# Altium schematic sheet 14-DPLL_1.SchDoc
size C; SheetNumber: 9; SheetTotal: 14
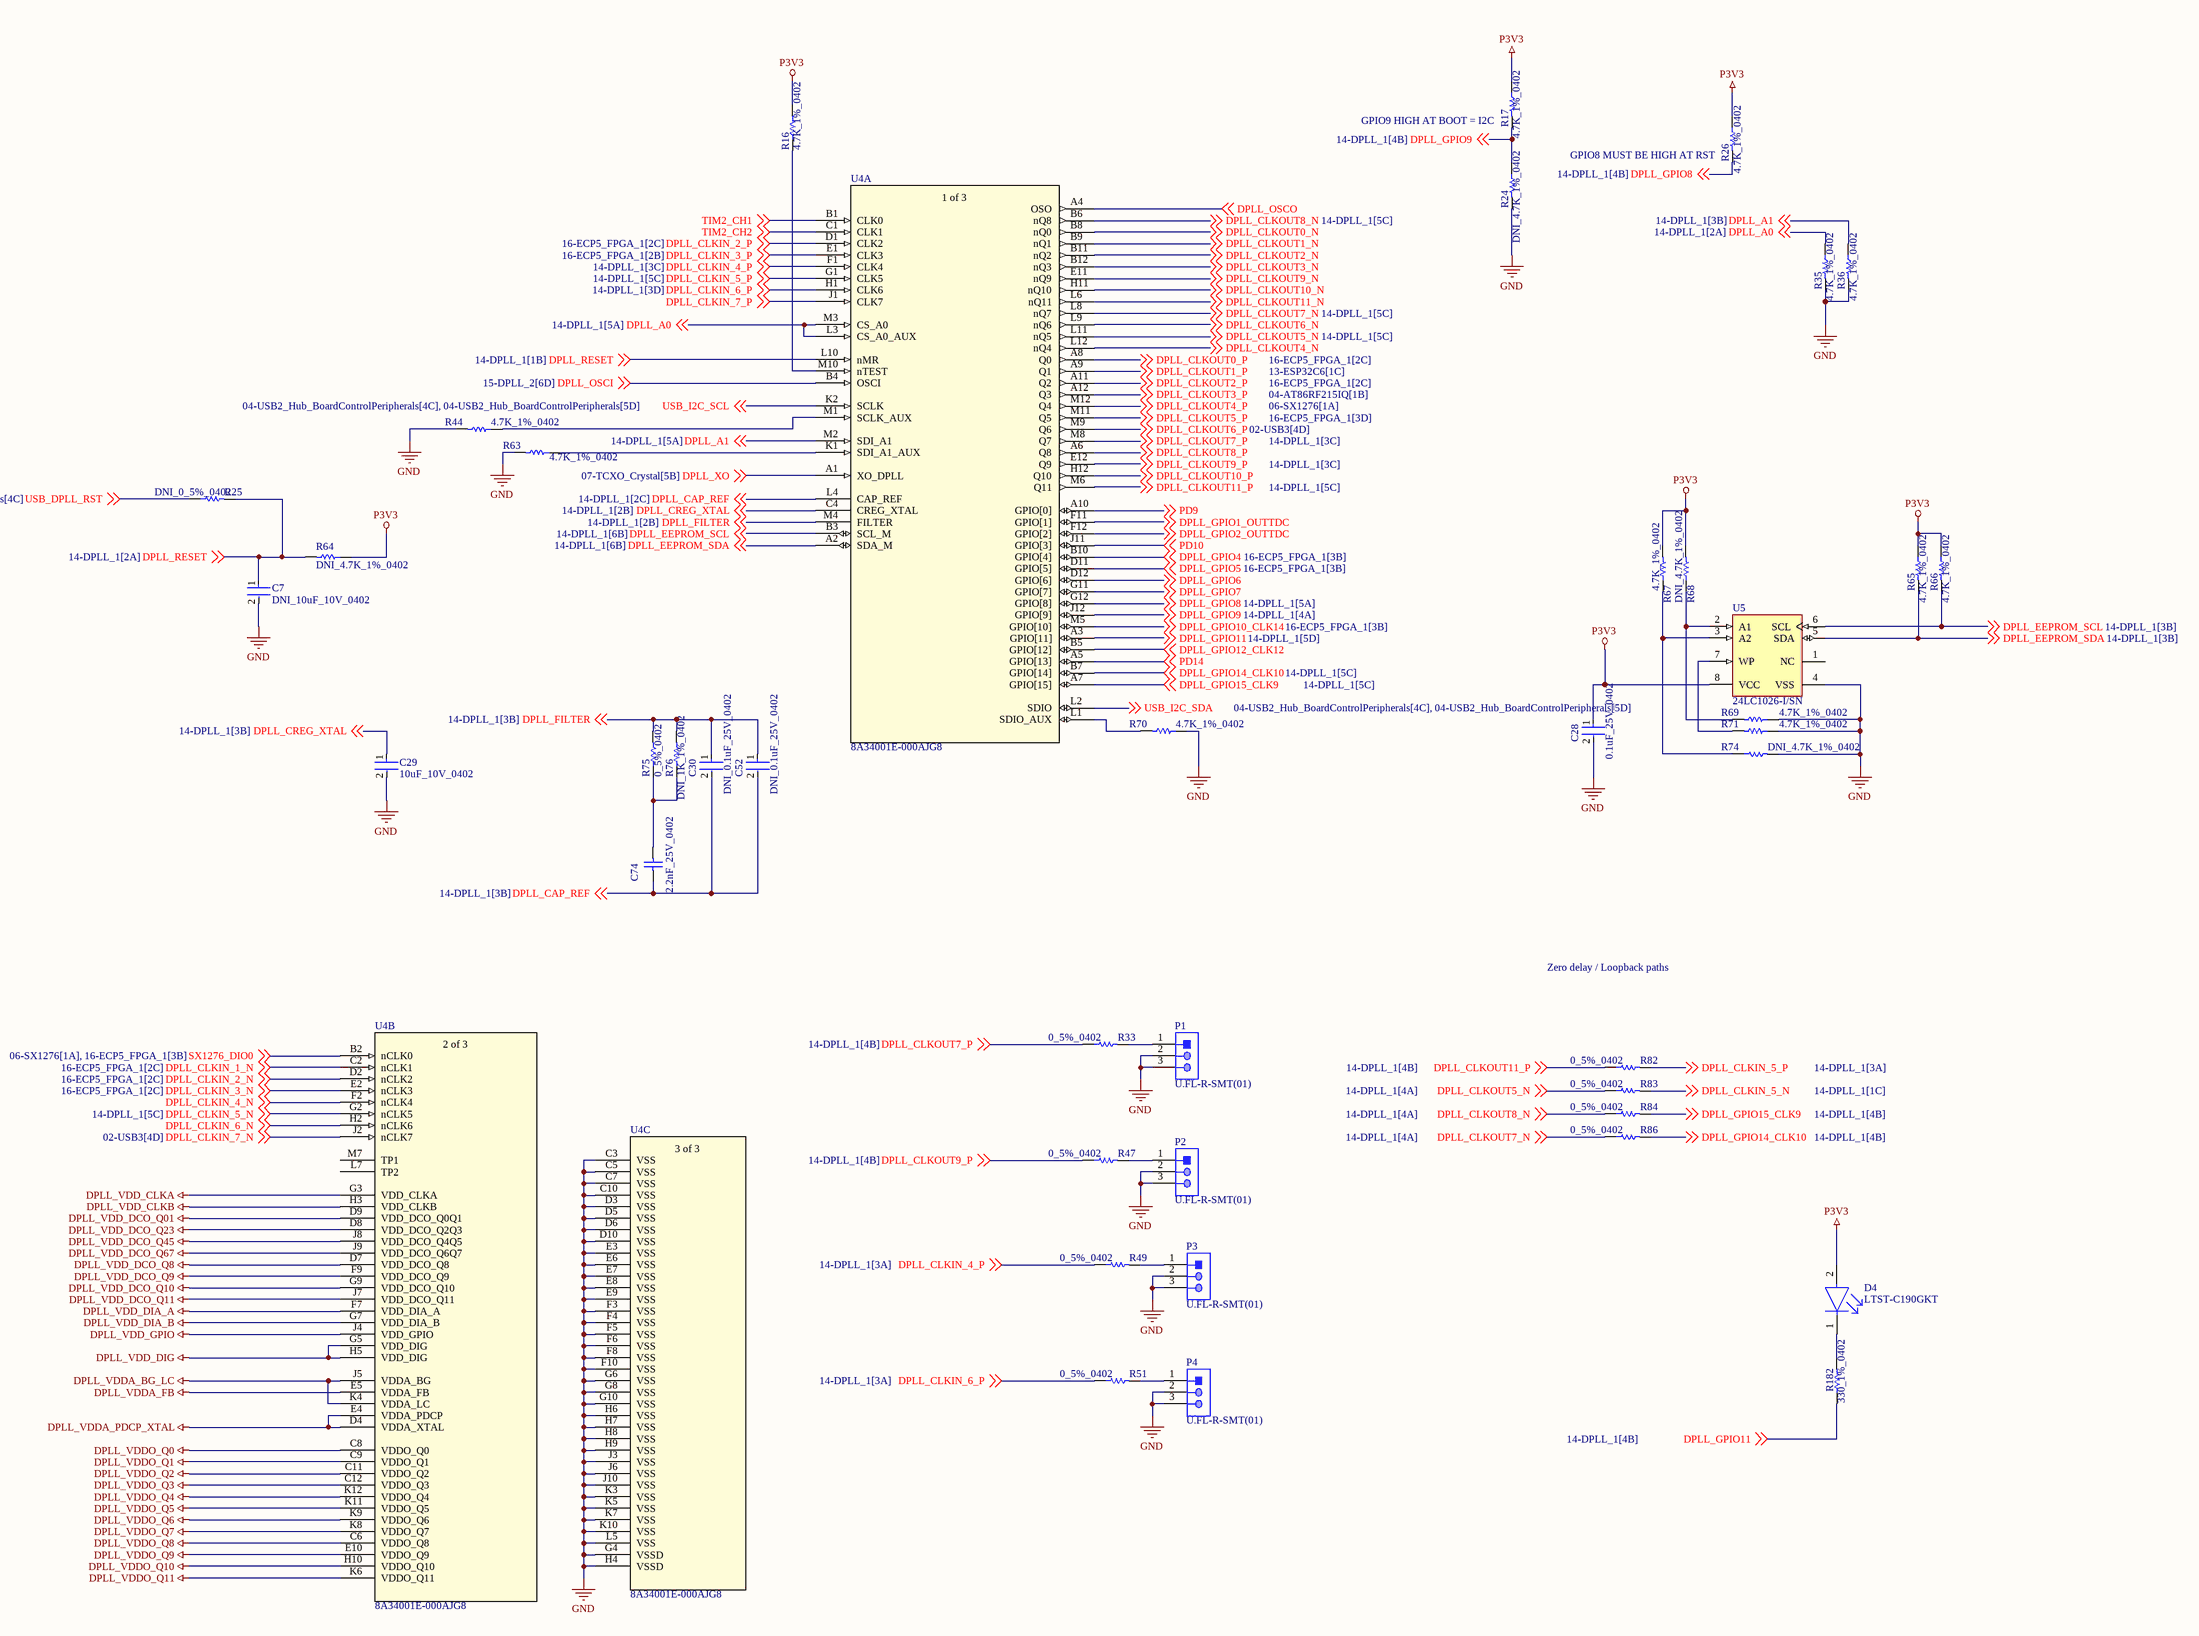
[diagram p0: 14-DPLL_1.SchDoc]

## Parts
C7  DNI_10uF_10V_0402  [FP-CL05A106MP5NUNC-MFG]  (no BOM)
C28  0.1uF_25V_0402  [FP-0402-L_1_0_1-W_0_5_0_1-IPC_C]
C29  10uF_10V_0402  [FP-CL05A106MP5NUNC-MFG]
C30  DNI_0.1uF_25V_0402  [FP-0402-L_1_0_1-W_0_5_0_1-IPC_C]  (no BOM)
C52  DNI_0.1uF_25V_0402  [FP-0402-L_1_0_1-W_0_5_0_1-IPC_C]  (no BOM)
C74  2.2nF_25V_0402  [CAPC1005X56X25LL10T15]
D4  LTST-C190GKT  [FP-LTST-C190GKT-MFG]
P1  U.FL-R-SMT(01)  [HRS-U.FL-R-SMT(10)_V]
P2  U.FL-R-SMT(01)  [HRS-U.FL-R-SMT(10)_V]
P3  U.FL-R-SMT(01)  [HRS-U.FL-R-SMT(10)_V]
P4  U.FL-R-SMT(01)  [HRS-U.FL-R-SMT(10)_V]
R16  4.7K_1%_0402  [RESC1005X40X25NL10T10]
R17  4.7K_1%_0402  [RESC1005X40X25NL10T10]
R24  DNI_4.7K_1%_0402  [RESC1005X40X25NL10T10]  (no BOM)
R25  DNI_0_5%_0402  [RESC1005X40X25LL10T10]  (no BOM)
R26  4.7K_1%_0402  [RESC1005X40X25NL10T10]
R33  0_5%_0402  [RESC1005X40X25LL10T10]
R35  4.7K_1%_0402  [RESC1005X40X25NL10T10]
R36  4.7K_1%_0402  [RESC1005X40X25NL10T10]
R44  4.7K_1%_0402  [RESC1005X40X25NL10T10]
R47  0_5%_0402  [RESC1005X40X25LL10T10]
R49  0_5%_0402  [RESC1005X40X25LL10T10]
R51  0_5%_0402  [RESC1005X40X25LL10T10]
R63  4.7K_1%_0402  [RESC1005X40X25NL10T10]
R64  DNI_4.7K_1%_0402  [RESC1005X40X25NL10T10]  (no BOM)
R65  4.7K_1%_0402  [RESC1005X40X25NL10T10]
R66  4.7K_1%_0402  [RESC1005X40X25NL10T10]
R67  4.7K_1%_0402  [RESC1005X40X25NL10T10]
R68  DNI_4.7K_1%_0402  [RESC1005X40X25NL10T10]  (no BOM)
R69  4.7K_1%_0402  [RESC1005X40X25NL10T10]
R70  4.7K_1%_0402  [RESC1005X40X25NL10T10]
R71  4.7K_1%_0402  [RESC1005X40X25NL10T10]
R74  DNI_4.7K_1%_0402  [RESC1005X40X25NL10T10]  (no BOM)
R75  0_5%_0402  [RESC1005X40X25LL10T10]
R76  DNI_1K_1%_0402  [RESC1005X40X25NL05T05]  (no BOM)
R82  0_5%_0402  [RESC1005X40X25LL10T10]
R83  0_5%_0402  [RESC1005X40X25LL10T10]
R84  0_5%_0402  [RESC1005X40X25LL10T10]
R86  0_5%_0402  [RESC1005X40X25LL10T10]
R182  330_1%_0402  [RESC1005X40X25NL10T10]
U4  8A34001E-000AJG8  [144-CABGA_REN]  (parts A,B,C of 3)
U5  24LC1026-I/SN  [MCHP-SOIC-SN8_N]

## Nets
DPLL_VDD_CLKA: U4.G3(VDD_CLKA)
DPLL_VDD_CLKB: U4.H3(VDD_CLKB)
DPLL_VDD_DCO_Q01: U4.D9(VDD_DCO_Q0Q1)
DPLL_VDD_DCO_Q8: U4.D7(VDD_DCO_Q8)
DPLL_VDD_DCO_Q9: U4.F9(VDD_DCO_Q9)
DPLL_VDD_DCO_Q10: U4.G9(VDD_DCO_Q10)
DPLL_VDD_DCO_Q11: U4.J7(VDD_DCO_Q11)
DPLL_VDD_DCO_Q23: U4.D8(VDD_DCO_Q2Q3)
DPLL_VDD_DCO_Q45: U4.J8(VDD_DCO_Q4Q5)
DPLL_VDD_DCO_Q67: U4.J9(VDD_DCO_Q6Q7)
DPLL_VDD_DIA_A: U4.F7(VDD_DIA_A)
DPLL_VDD_DIA_B: U4.G7(VDD_DIA_B)
DPLL_VDD_DIG: U4.G5(VDD_DIG) U4.H5(VDD_DIG)
DPLL_VDD_GPIO: U4.J4(VDD_GPIO)
DPLL_VDDA_BG_LC: U4.J5(VDDA_BG) U4.K4(VDDA_LC)
DPLL_VDDA_FB: U4.E5(VDDA_FB)
DPLL_VDDA_PDCP_XTAL: U4.D4(VDDA_XTAL) U4.E4(VDDA_PDCP)
DPLL_VDDO_Q0: U4.C8(VDDO_Q0)
DPLL_VDDO_Q1: U4.C9(VDDO_Q1)
DPLL_VDDO_Q2: U4.C11(VDDO_Q2)
DPLL_VDDO_Q3: U4.C12(VDDO_Q3)
DPLL_VDDO_Q4: U4.K12(VDDO_Q4)
DPLL_VDDO_Q5: U4.K11(VDDO_Q5)
DPLL_VDDO_Q6: U4.K9(VDDO_Q6)
DPLL_VDDO_Q7: U4.K8(VDDO_Q7)
DPLL_VDDO_Q8: U4.C6(VDDO_Q8)
DPLL_VDDO_Q9: U4.E10(VDDO_Q9)
DPLL_VDDO_Q10: U4.H10(VDDO_Q10)
DPLL_VDDO_Q11: U4.K6(VDDO_Q11)
GND: C7.2 C28.2 C29.2 P1.2 P1.3 P2.2 P2.3 P3.2 P3.3 P4.2 P4.3 R24.2 R35.2 R36.2 R44.2 R63.2 R69.1 R70.1 R71.1 R74.2 U4.C3(VSS) U4.C5(VSS) U4.C7(VSS) U4.C10(VSS) U4.D3(VSS) U4.D5(VSS) U4.D6(VSS) U4.D10(VSS) U4.E3(VSS) U4.E6(VSS) U4.E7(VSS) U4.E8(VSS) U4.E9(VSS) U4.F3(VSS) U4.F4(VSS) U4.F5(VSS) U4.F6(VSS) U4.F8(VSS) U4.F10(VSS) U4.G4(VSSD) U4.G6(VSS) U4.G8(VSS) U4.G10(VSS) U4.H4(VSSD) U4.H6(VSS) U4.H7(VSS) U4.H8(VSS) U4.H9(VSS) U4.J3(VSS) U4.J6(VSS) U4.J10(VSS) U4.K3(VSS) U4.K5(VSS) U4.K7(VSS) U4.K10(VSS) U4.L5(VSS) U5.4(VSS)
P3V3: C28.1 D4.2(A) R16.2 R17.1 R26.1 R64.1 R65.1 R66.1 R67.2 R68.2 U5.8(VCC)
DPLL_A0: R35.1 U4.L3(CS_A0_AUX) U4.M3(CS_A0) ; off-sheet DPLL_A0
DPLL_A1: R36.1 U4.M2(SDI_A1) ; off-sheet DPLL_A1
DPLL_CAP_REF: C30.2 C52.2 C74.1 U4.L4(CAP_REF) ; off-sheet DPLL_CAP_REF
DPLL_CLKIN_1_N: U4.C2(nCLK1) ; off-sheet DPLL_CLKIN_1_N
DPLL_CLKIN_2_N: U4.D2(nCLK2) ; off-sheet DPLL_CLKIN_2_N
DPLL_CLKIN_2_P: U4.D1(CLK2) ; off-sheet DPLL_CLKIN_2_P
DPLL_CLKIN_3_N: U4.E2(nCLK3) ; off-sheet DPLL_CLKIN_3_N
DPLL_CLKIN_3_P: U4.E1(CLK3) ; off-sheet DPLL_CLKIN_3_P
DPLL_CLKIN_4_N: U4.F2(nCLK4) ; off-sheet DPLL_CLKIN_4_N
DPLL_CLKIN_4_P: R49.1 U4.F1(CLK4) ; off-sheet DPLL_CLKIN_4_P
DPLL_CLKIN_5_N: R83.2 U4.G2(nCLK5) ; off-sheet DPLL_CLKIN_5_N
DPLL_CLKIN_5_P: R82.2 U4.G1(CLK5) ; off-sheet DPLL_CLKIN_5_P
DPLL_CLKIN_6_N: U4.H2(nCLK6) ; off-sheet DPLL_CLKIN_6_N
DPLL_CLKIN_6_P: R51.1 U4.H1(CLK6) ; off-sheet DPLL_CLKIN_6_P
DPLL_CLKIN_7_N: U4.J2(nCLK7) ; off-sheet DPLL_CLKIN_7_N
DPLL_CLKIN_7_P: U4.J1(CLK7) ; off-sheet DPLL_CLKIN_7_P
DPLL_CLKOUT0_N: U4.B8(nQ0) ; off-sheet DPLL_CLKOUT0_N
DPLL_CLKOUT0_P: U4.A8(Q0) ; off-sheet DPLL_CLKOUT0_P
DPLL_CLKOUT1_N: U4.B9(nQ1) ; off-sheet DPLL_CLKOUT1_N
DPLL_CLKOUT1_P: U4.A9(Q1) ; off-sheet DPLL_CLKOUT1_P
DPLL_CLKOUT2_N: U4.B11(nQ2) ; off-sheet DPLL_CLKOUT2_N
DPLL_CLKOUT2_P: U4.A11(Q2) ; off-sheet DPLL_CLKOUT2_P
DPLL_CLKOUT3_N: U4.B12(nQ3) ; off-sheet DPLL_CLKOUT3_N
DPLL_CLKOUT3_P: U4.A12(Q3) ; off-sheet DPLL_CLKOUT3_P
DPLL_CLKOUT4_N: U4.L12(nQ4) ; off-sheet DPLL_CLKOUT4_N
DPLL_CLKOUT4_P: U4.M12(Q4) ; off-sheet DPLL_CLKOUT4_P
DPLL_CLKOUT5_N: R83.1 U4.L11(nQ5) ; off-sheet DPLL_CLKOUT5_N
DPLL_CLKOUT5_P: U4.M11(Q5) ; off-sheet DPLL_CLKOUT5_P
DPLL_CLKOUT6_N: U4.L9(nQ6) ; off-sheet DPLL_CLKOUT6_N
DPLL_CLKOUT6_P: U4.M9(Q6) ; off-sheet DPLL_CLKOUT6_P
DPLL_CLKOUT7_N: R86.1 U4.L8(nQ7) ; off-sheet DPLL_CLKOUT7_N
DPLL_CLKOUT7_P: R33.1 U4.M8(Q7) ; off-sheet DPLL_CLKOUT7_P
DPLL_CLKOUT8_N: R84.1 U4.B6(nQ8) ; off-sheet DPLL_CLKOUT8_N
DPLL_CLKOUT8_P: U4.A6(Q8) ; off-sheet DPLL_CLKOUT8_P
DPLL_CLKOUT9_N: U4.E11(nQ9) ; off-sheet DPLL_CLKOUT9_N
DPLL_CLKOUT9_P: R47.1 U4.E12(Q9) ; off-sheet DPLL_CLKOUT9_P
DPLL_CLKOUT10_N: U4.H11(nQ10) ; off-sheet DPLL_CLKOUT10_N
DPLL_CLKOUT10_P: U4.H12(Q10) ; off-sheet DPLL_CLKOUT10_P
DPLL_CLKOUT11_N: U4.L6(nQ11) ; off-sheet DPLL_CLKOUT11_N
DPLL_CLKOUT11_P: R82.1 U4.M6(Q11) ; off-sheet DPLL_CLKOUT11_P
DPLL_CREG_XTAL: C29.1 U4.C4(CREG_XTAL) ; off-sheet DPLL_CREG_XTAL
DPLL_EEPROM_SCL: R66.2 U4.B3(SCL_M) U5.6(SCL) ; off-sheet DPLL_EEPROM_SCL
DPLL_EEPROM_SDA: R65.2 U4.A2(SDA_M) U5.5(SDA) ; off-sheet DPLL_EEPROM_SDA
DPLL_FILTER: C30.1 C52.1 R75.2 R76.2 U4.M4(FILTER) ; off-sheet DPLL_FILTER
DPLL_GPIO1_OUTTDC: U4.F11(GPIO[1]) ; off-sheet DPLL_GPIO1_OUTTDC
DPLL_GPIO2_OUTTDC: U4.F12(GPIO[2]) ; off-sheet DPLL_GPIO2_OUTTDC
DPLL_GPIO4: U4.B10(GPIO[4]) ; off-sheet DPLL_GPIO4
DPLL_GPIO5: U4.D11(GPIO[5]) ; off-sheet DPLL_GPIO5
DPLL_GPIO6: U4.D12(GPIO[6]) ; off-sheet DPLL_GPIO6
DPLL_GPIO7: U4.G11(GPIO[7]) ; off-sheet DPLL_GPIO7
DPLL_GPIO8: R26.2 U4.G12(GPIO[8]) ; off-sheet DPLL_GPIO8
DPLL_GPIO9: R17.2 R24.1 U4.J12(GPIO[9]) ; off-sheet DPLL_GPIO9
DPLL_GPIO10_CLK14: U4.M5(GPIO[10]) ; off-sheet DPLL_GPIO10_CLK14
DPLL_GPIO11: R182.1 U4.A3(GPIO[11]) ; off-sheet DPLL_GPIO11
DPLL_GPIO12_CLK12: U4.B5(GPIO[12]) ; off-sheet DPLL_GPIO12_CLK12
DPLL_GPIO14_CLK10: R86.2 U4.B7(GPIO[14]) ; off-sheet DPLL_GPIO14_CLK10
DPLL_GPIO15_CLK9: R84.2 U4.A7(GPIO[15]) ; off-sheet DPLL_GPIO15_CLK9
DPLL_OSCI: U4.B4(OSCI) ; off-sheet DPLL_OSCI
DPLL_OSCO: U4.A4(OSO) ; off-sheet DPLL_OSCO
DPLL_RESET: C7.1 R25.2 R64.2 U4.L10(nMR) ; off-sheet DPLL_RESET
DPLL_XO: U4.A1(XO_DPLL) ; off-sheet DPLL_XO
PD9: U4.A10(GPIO[0]) ; off-sheet PD9
PD10: U4.J11(GPIO[3]) ; off-sheet PD10
PD14: U4.A5(GPIO[13]) ; off-sheet PD14
SX1276_DIO0: U4.B2(nCLK0) ; off-sheet SX1276_DIO0
TIM2_CH1: U4.B1(CLK0) ; off-sheet TIM2_CH1
TIM2_CH2: U4.C1(CLK1) ; off-sheet TIM2_CH2
USB_DPLL_RST: R25.1 ; off-sheet USB_DPLL_RST
USB_I2C_SCL: U4.K2(SCLK) ; off-sheet USB_I2C_SCL
USB_I2C_SDA: U4.L2(SDIO) ; off-sheet USB_I2C_SDA
NetC74_2: C74.2 R75.1 R76.1
NetD4_1: D4.1(C) R182.2
NetP1_1: P1.1 R33.2
NetP2_1: P2.1 R47.2
NetP3_1: P3.1 R49.2
NetP4_1: P4.1 R51.2
NetR16_1: R16.1 U4.M10(nTEST)
NetR44_1: R44.1 U4.M1(SCLK_AUX)
NetR63_1: R63.1 U4.K1(SDI_A1_AUX)
NetR67_1: R67.1 R74.1 U5.3(A2)
NetR68_1: R68.1 R69.2 U5.2(A1)
NetR70_2: R70.2 U4.L1(SDIO_AUX)
NetR71_2: R71.2 U5.7(WP)

Not connected (* = marked no-connect by the designer): U4 L7(TP2) M7(TP1); U5 1(NC)

## Notes on the sheet
- (near R17) GPIO9 HIGH AT BOOT = I2C
- (near R26) GPIO8 MUST BE HIGH AT RST
- Zero delay / Loopback paths
- (in symbol 8A34001E-000AJG8, part A) 1 of 3
- (in symbol 8A34001E-000AJG8, part B) 2 of 3
- (in symbol 8A34001E-000AJG8, part C) 3 of 3

## Library data of the parts
C7 C29 = CMP-13271-000002-1: CAP CER 10UF 10V X5R 0402; Manufacturer Part Number: CL05A106MP5NUNC; Manufacturer: Samsung; Temperature Coefficient: 15%; Tolerance: 20%; Material: Ceramic; Octopart: https://octopart.com/cl05a106mp5nunc-samsung-22457395; Voltage Rating: 10V; RoHS: TRUE; Value: 10uF; Height: 0.7mm; Digikey Description: CAP CER 10UF 10V X5R 0402; Automotive: No; Package: CL05A106MP5NUNC; Device Class L1: Passive Components; Capacitance: 10uF; Temperature Range High: +85°C; ComponentLink2Description: Datasheet; Device Class L2: Capacitors; Temperature Characteristic: X5R; Temperature: -55°C to +85°C; ComponentLink2URL: http://www.samsungsem.com/kr/support/product-search/mlcc/__icsFiles/afieldfile/2019/05/10/19-CL05A106MP5NUNC.pdf; Device Class L3: Ceramic Capacitors; Category: Cap; Temperature Range Low: -55°C; Ipc Land Pattern Name: CAPC10050X50; Lead Free: Yes
C28 C30 C52 = CMP-2008-02519-2: General Purpose Ceramic Capacitor, 0402, 100nF, 10%, X7R, 15%, 25V; Package Quantity: 1; Capacitance: 100nF; Min Operating Temperature: -55°C; Voltage: 25V; Voltage Rating: 25V; Construction: Flat; Max Operating Temperature: 125°C; Radiation Hardening: No; Depth: 0.5mm; Thickness: 0.022inch; Voltage Rating (DC): 25V; Number of Pins: 2; Lead Free: Lead Free; Series: -; REACH SVHC: No SVHC; Length: 1mm; Dielectric: X7R; RoHS Compliant: Yes; Mount: Surface Mount; Packaging: Tape and Reel; Case/Package: 0402; Case Code (Imperial): 0402; Termination: SMD/SMT; Width: 0.02inch; Case Code (Metric): 1005; Tolerance: 10%
C74 = CMP-2008-02907-1: Manufacturer: AVX Interconnect / Elco; Part Number: 04025C222JAT2A
D4 = CMP-22017-000005-2: LED GREEN CLEAR CHIP SMD; Dominant Wavelength: 569nm; Reverse Voltage: 5V; Lens Color: Colorless; Viewing Angle: 130°; Voltage: 2V; Forward Current: 30mA; Power Dissipation: 100mW; Luminous Intensity: 6mcd; Number of LEDs: 1; Forward Voltage: 2.1V; Wavelength: 565nm; Test Current: 10mA; Min Operating Temperature: -55°C; Lens Style: Clear; Mount: Surface Mount; Width: 0.8mm; Packaging: Tape and Reel; Lens Transparency: Clear; Case Code (Metric): 1608; Depth: 0.8mm; Case Code (Imperial): 0603; Case/Package: 0603; Number of Pins: 2; Max Operating Temperature: 85°C; Lead Free: Lead Free; Number of Elements: 1; Length: 1.6mm; Height: 0.8mm; Package Quantity: 1; Power Rating: 100mW; Radiation Hardening: No; Illumination Color: Green; Color: Green
P1-P4 = CMP-2000-05151-1: CONN RECPT ULTRA-MINI COAX SMD; Manufacturer: Hirose Electric; Centre Contact Resistance: 25mohm; Voltage Rating V AC: 60V; Female Contact Material: PhosphorBronze; Contact Resistance: 10mohm; Male Contact Material: Brass; Connector Type: UFLCoaxial; Connector Mounting: PCB; Impedance: 50ohm; Insulation Resistance: 500Mohm; Secondary Insulation Material: PBT; Frequency Max: 6GHz; Body Plating: Silver; External Length / Height: 2.5mm; Approval Category: UL94V-0; Female Contact Plating: Gold; Connector Mounting Orientation: PCBoard; VSWR: 1.3; Coaxial Termination: Solder; Body Style: StraightJack; SVHC: NoSVHC(18-Jun-2012); Jacket Material: LCP; Package Reference: U.FL-R-SMT(10); Datasheet Version: Feb-04; Outer Contact Resistance: 10mohm; Contact Plating: Gold; Mounting Type: PCBoard; Flammability Rating: UL94V-0; Operating Frequency Max: 6GHz; Termination Method: Solder; Male Contact Plating: Gold; Package Description: 3-Pin Surface Mount Device, Body 2.6 x 2.6 mm; Operating Temperature Min: -40degC; Manufacturer URL: https://www.hirose.com; Operating Temperature Max: 90degC; Contact Material: PhosphorBronze; Datasheet URL: http://www.farnell.com/datasheets/91524.pdf; Material: PhosphorBronze
R16 R17 R24 R26 R35 R36 R44 R63-R71 R74 = CMP-2002-05217-1: Manufacturer: Bourns; Part Number: CR0402-FX-4701GLF
R25 R33 R47 R49 R51 R75 R82-R84 R86 = CMP-2002-04569-1: Manufacturer: KOA Speer; Part Number: RK73Z1ETTP
R76 = CMP-2002-08277-1: Manufacturer: Vishay Dale; Part Number: CRCW04021K00FKTD
R182 = CMP-2002-05853-1: Manufacturer: Panasonic; Part Number: ERA-2AED331X
U4 = 8A34001E-000AJG8: No Description Available; Mfr_Name: Renesas Electronics; Copyright: Copyright (C) 2024 Ultra Librarian. All rights reserved.; Manufacturer_Part_Number: 8A34001E-000AJG8; RefDes: RefDes; Type: DEV
U5 = CMP-0159-01024-1: 1024K bits I2C™ Serial EEPROM, 2.5 to 5.5 V, 400 kHz, -40 to 85 degC, 8-pin SOIC (SN8), Tube; Manufacturer: Microchip; DatasheetVersion: Rev. C; ComponentLink3Description: Package Specification; ComponentLink1URL: http://www.microchip.com; Mounting Technology: Surface Mount; ComponentLink4URL: http://www.microchip.com/24LC1026; ComponentLink2Description: Datasheet; PartNumber: 24LC1026-I/SN; PackageReference: SOIC-SN8; PackageDescription: 8-Lead Plastic Small Outline, 4.9 x 3.9 mm Body, 1.27 mm Pitch; ComponentLink1Description: Manufacturer URL; ComponentLink3URL: http://www.microchip.com/stellent/groups/techpub_sg/documents/packagingspec/en012702.pdf; ComponentLink2URL: http://ww1.microchip.com/downloads/en/DeviceDoc/22270C.pdf; PackageVersion: C04-057C; ComponentLink4Description: Product URL